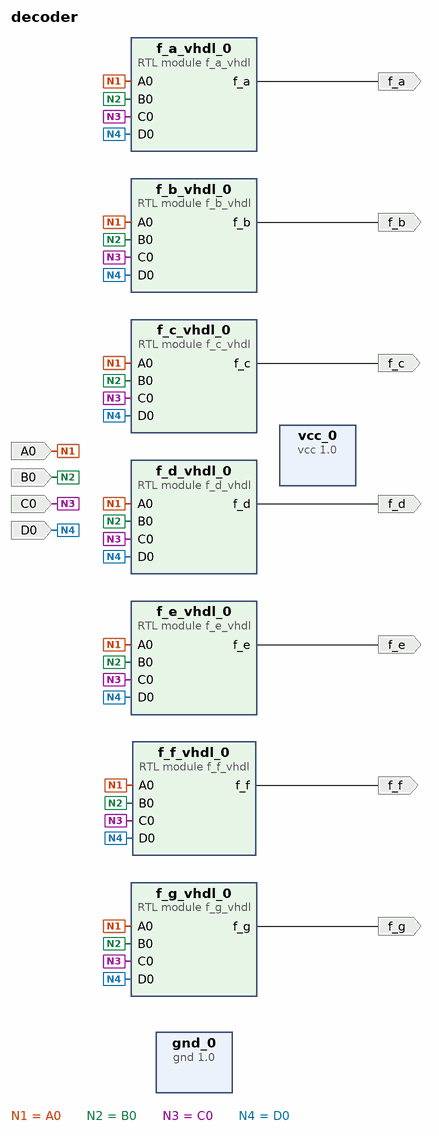
[diagram p0: block diagram of the top level]
# Vivado block design decoder, xc7a35tcpg236-1, Vivado 2018.3
create_bd_design decoder

create_bd_port -dir I A0
create_bd_port -dir I B0
create_bd_port -dir I C0
create_bd_port -dir I D0
create_bd_port -dir O f_a
create_bd_port -dir O f_b
create_bd_port -dir O f_c
create_bd_port -dir O f_d
create_bd_port -dir O f_e
create_bd_port -dir O f_f
create_bd_port -dir O f_g

create_bd_cell -type module -reference f_a_vhdl f_a_vhdl_0
create_bd_cell -type module -reference f_b_vhdl f_b_vhdl_0
create_bd_cell -type module -reference f_c_vhdl f_c_vhdl_0
create_bd_cell -type module -reference f_d_vhdl f_d_vhdl_0
create_bd_cell -type module -reference f_e_vhdl f_e_vhdl_0
create_bd_cell -type module -reference f_f_vhdl f_f_vhdl_0
create_bd_cell -type module -reference f_g_vhdl f_g_vhdl_0
create_bd_cell -type ip -vlnv FIT:user:gnd:1.0 gnd_0
create_bd_cell -type ip -vlnv FIT:user:vcc:1.0 vcc_0

# ---- connections ----

connect_bd_net -net A0_0_1 [get_bd_ports A0] \
  [get_bd_pins f_a_vhdl_0/A0] [get_bd_pins f_b_vhdl_0/A0] [get_bd_pins f_c_vhdl_0/A0] [get_bd_pins f_d_vhdl_0/A0] \
  [get_bd_pins f_e_vhdl_0/A0] [get_bd_pins f_f_vhdl_0/A0] [get_bd_pins f_g_vhdl_0/A0]
connect_bd_net -net B0_0_1 [get_bd_ports B0] \
  [get_bd_pins f_a_vhdl_0/B0] [get_bd_pins f_b_vhdl_0/B0] [get_bd_pins f_c_vhdl_0/B0] [get_bd_pins f_d_vhdl_0/B0] \
  [get_bd_pins f_e_vhdl_0/B0] [get_bd_pins f_f_vhdl_0/B0] [get_bd_pins f_g_vhdl_0/B0]
connect_bd_net -net C0_0_1 [get_bd_ports C0] \
  [get_bd_pins f_a_vhdl_0/C0] [get_bd_pins f_b_vhdl_0/C0] [get_bd_pins f_c_vhdl_0/C0] [get_bd_pins f_d_vhdl_0/C0] \
  [get_bd_pins f_e_vhdl_0/C0] [get_bd_pins f_f_vhdl_0/C0] [get_bd_pins f_g_vhdl_0/C0]
connect_bd_net -net D0_0_1 [get_bd_ports D0] \
  [get_bd_pins f_a_vhdl_0/D0] [get_bd_pins f_b_vhdl_0/D0] [get_bd_pins f_c_vhdl_0/D0] [get_bd_pins f_d_vhdl_0/D0] \
  [get_bd_pins f_e_vhdl_0/D0] [get_bd_pins f_f_vhdl_0/D0] [get_bd_pins f_g_vhdl_0/D0]
connect_bd_net [get_bd_pins f_a_vhdl_0/f_a] [get_bd_ports f_a]
connect_bd_net [get_bd_pins f_b_vhdl_0/f_b] [get_bd_ports f_b]
connect_bd_net [get_bd_pins f_c_vhdl_0/f_c] [get_bd_ports f_c]
connect_bd_net [get_bd_pins f_d_vhdl_0/f_d] [get_bd_ports f_d]
connect_bd_net [get_bd_pins f_e_vhdl_0/f_e] [get_bd_ports f_e]
connect_bd_net [get_bd_pins f_f_vhdl_0/f_f] [get_bd_ports f_f]
connect_bd_net [get_bd_pins f_g_vhdl_0/f_g] [get_bd_ports f_g]

validate_bd_design
save_bd_design
